# Altium project CT_ESP32.PrjPcb
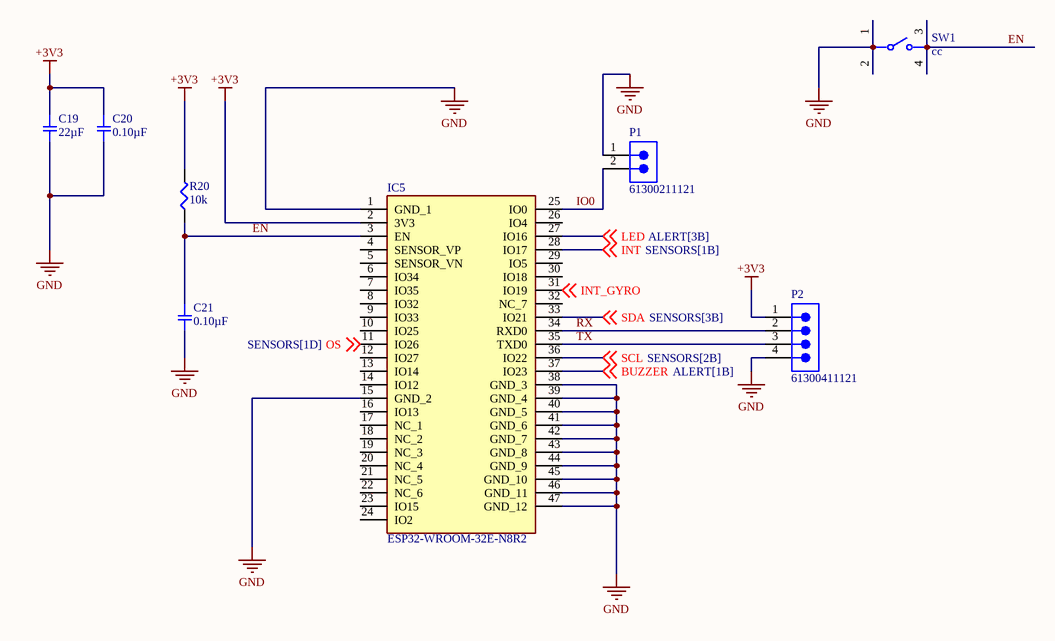
[diagram p0: MCU.SchDoc]
5 sheets, 71 parts. Net scope: global (net labels, ports and power ports of the same name join across sheets).
Board file: PCB1.PcbDoc
Sheets:
  MCU.SchDoc
  POWER.SchDoc
  CHARGING.SchDoc
  ALERT.SchDoc
  SENSORS.SchDoc

## Sheet MCU.SchDoc
size A; SheetNumber: 1; SheetTotal: 5

### Parts
C19  22µF  [SMD-0603C]
C20  0.10µF  [SMD-0603C]
C21  0.10µF  [SMD-0402C]
IC5  ESP32-WROOM-32E-N8R2  [ESP32WROOM32EN8R2]
P1  61300211121  [61300211121]
P2  61300411121  [61300411121]
R20  10k  [SMD-0402-RES]
SW1  cc  [FP-TL3305AF260QG-MFG]

### Nets
+3V3: C19.1 C20.1 IC5.2(3V3) P2.1 R20.2
GND: C19.2 C20.2 C21.2 IC5.1(GND_1) IC5.15(GND_2) IC5.38(GND_3) IC5.39(GND_4) IC5.40(GND_5) IC5.41(GND_6) IC5.42(GND_7) IC5.43(GND_8) IC5.44(GND_9) IC5.45(GND_10) IC5.46(GND_11) IC5.47(GND_12) P1.1 P2.4 SW1.1 SW1.2
BUZZER: IC5.37(IO23) ; off-sheet BUZZER
EN: C21.1 IC5.3(EN) R20.1 SW1.3 SW1.4
INT: IC5.28(IO17) ; off-sheet INT
INT_GYRO: IC5.31(IO19) ; off-sheet INT_GYRO
IO0: IC5.25(IO0) P1.2
LED: IC5.27(IO16) ; off-sheet LED
OS: IC5.11(IO26) ; off-sheet OS
RX: IC5.34(RXD0) P2.2
SCL: IC5.36(IO22) ; off-sheet SCL
SDA: IC5.33(IO21) ; off-sheet SDA
TX: IC5.35(TXD0) P2.3

Not connected (* = marked no-connect by the designer): IC5 4(SENSOR_VP) 5(SENSOR_VN) 6(IO34) 7(IO35) 8(IO32) 9(IO33) 10(IO25) 12(IO27) 13(IO14) 14(IO12) 16(IO13) 17(NC_1) 18(NC_2) 19(NC_3) 20(NC_4) 21(NC_5) 22(NC_6) 23(IO15) 24(IO2) 26(IO4) 29(IO5) 30(IO18) 32(NC_7)

### Library data of the parts
C19 = ZRB18AR60J226ME01L: CAP CER 22UF 6.3V X5R 0603; Manufacturer: Murata Electronics North America; Factory Stock: 0; Unit Price (USD): 0.44; Minimum Quantity: 1; Tolerance: ±20%; Datasheets: http://search.murata.co.jp/Ceramy/image/img/A01X/G101/ENG/ZRB18AR60J226ME01-01.pdf; Image: //media.digikey.com/Renders/Murata%20Renders/ZRB-SERIES-0603.jpg; Digi-Key Part Number: 490-10988-1-ND; Part Number: ZRB18AR60J226ME01L; Quantity Available: 3040; @ qty: 0; Packaging: Cut Tape (CT); Series: ZRB; Part Status: Active; Value: 22µF; Voltage: 6.3V; Temperature Coefficient: X5R; Operating Temperature: -55°C ~ 85°C; Features: Derating Recommended, Interposer Termination; Ratings: -; Applications: Acoustic Noise Reduction; Mounting Type: Surface Mount, MLCC; Package / Case: 0603 (1608 Metric); Size / Dimension: 0.063" L x 0.031" W (1.60mm x 0.80mm); Height - Seated (Max): -; Thickness (Max): 0.047" (1.20mm); Lead Spacing: -; Lead Style: -
C20 = GCJ188R71C104KA01D: CAP CER 0.1UF 16V X7R 0603; Manufacturer: Murata Electronics North America; Factory Stock: 0; Unit Price (USD): 0.21; Minimum Quantity: 1; Tolerance: ±10%; Datasheets: http://www.murata.com/~/media/webrenewal/support/library/catalog/products/capacitor/mlcc/c03e.ashx; Image: //media.digikey.com/Renders/Murata%20Renders/0603%28LQG18%29.jpg; Digi-Key Part Number: 490-5796-1-ND; Part Number: GCJ188R71C104KA01D; Quantity Available: 22473; @ qty: 0; Packaging: Cut Tape (CT); Series: GCJ; Part Status: Active; Value: 0.10µF; Voltage: 16V; Temperature Coefficient: X7R; Operating Temperature: -55°C ~ 125°C; Features: Soft Termination; Ratings: AEC-Q200; Applications: Automotive, Boardflex Sensitive; Mounting Type: Surface Mount, MLCC; Package / Case: 0603 (1608 Metric); Size / Dimension: 0.063" L x 0.031" W (1.60mm x 0.80mm); Height - Seated (Max): -; Thickness (Max): 0.035" (0.90mm); Lead Spacing: -; Lead Style: -
C21 = GCM155R71C104KA55D: CAP CER 0.1UF 16V X7R 0402; Manufacturer: Murata Electronics North America; Factory Stock: 0; Unit Price (USD): 0.1; Minimum Quantity: 1; Tolerance: ±10%; Datasheets: http://www.murata.com/~/media/webrenewal/support/library/catalog/products/capacitor/mlcc/c03e.ashx; Image: //media.digikey.com/Renders/Murata%20Renders/ZRB-SERIES-0402.jpg; Digi-Key Part Number: 490-4759-1-ND; Part Number: GCM155R71C104KA55D; Quantity Available: 734194; @ qty: 0; Packaging: Cut Tape (CT); Series: GCM; Part Status: Active; Value: 0.10µF; Voltage: 16V; Temperature Coefficient: X7R; Operating Temperature: -55°C ~ 125°C; Features: -; Ratings: AEC-Q200; Applications: Automotive; Mounting Type: Surface Mount, MLCC; Package / Case: 0402 (1005 Metric); Size / Dimension: 0.039" L x 0.020" W (1.00mm x 0.50mm); Height - Seated (Max): -; Thickness (Max): 0.022" (0.55mm); Lead Spacing: -; Lead Style: -
IC5 = ESP32-WROOM-32E-N8R2: Integrated Circuit; Manufacturer_Name: Espressif Systems; Datasheet Link: https://www.espressif.com/sites/default/files/documentation/esp32-wroom-32e_esp32-wroom-32ue_datasheet_en.pdf; Height: 3.25mm; Manufacturer_Part_Number: ESP32-WROOM-32E-N8R2; Mouser Part Number: 356-ESP32WRM32EN8R2; Mouser Price/Stock: https://www.mouser.co.uk/ProductDetail/Espressif-Systems/ESP32-WROOM-32E-N8R2?qs=By6Nw2ByBD0mvGJSS3Ohlw%3D%3D
P1 = CMP-1712-00002-6: NexarPartId: 20081794; Number of Contacts: 2; Pitch: 2.54mm; Connector Type: Male Pin; Voltage Rating: 250V; Current Rating: 3A; Gender: Male; Contact Resistance: 20mΩ; Height: 8.94mm; Lead Free: Lead Free; Number of Pins: 2; Termination: Through Hole; RoHS: Compliant; Lead Pitch: 2.54mm; REACH SVHC: No SVHC; Housing Material: PBT; Contact Mating Length: 5.9944mm; Min Operating Temperature: -40°C; Orientation: Vertical; Contact Material: Copper; Contact Gender: Male; Max Operating Temperature: 125°C; Number of Rows: 1; Number of Positions: 2; Packaging: Bulk; Contact Plating: Gold; Mount: Through Hole; Color: Black; Operating Supply Voltage: 250V
P2 = CMP-1502-01064-3: NexarPartId: 32855522; Operating Supply Voltage: 250V; Pitch: 2.54mm; Contact Resistance: 20mΩ; Number of Positions: 4; Current Rating: 3A; Connector Type: Male Pin; Gender: Male; Contact Plating: Gold; Height: 8.89mm; Lead Pitch: 2.54mm; Lead Free: Lead Free; Contact Mating Length: 5.9944mm; Number of Rows: 1; Termination: Solder; Packaging: Bulk; REACH SVHC: Unknown; Min Operating Temperature: -40°C; RoHS: Compliant; Number of Contacts: 4; Voltage Rating: 250V; Color: Black; Max Operating Temperature: 105°C; Contact Material: Copper; Mount: Through Hole; Orientation: Vertical; Number of Pins: 4
R20 = ERJ-2GEJ103X: RES SMD 10K OHM 5% 1/10W 0402; Manufacturer: Panasonic Electronic Components; Factory Stock: 0; Unit Price (USD): 0.00350; @ qty: 1500; Minimum Quantity: 1; Power (Watts): 0.1W, 1/10W; Temperature Coefficient: ±200ppm/°C; Part Number: ERJ-2GEJ103X; Datasheets: http://industrial.panasonic.com/www-cgi/jvcr13pz.cgi?E+PZ+3+AOA0001+ERJ2GEJ103X+7+WW; Image: //media.digikey.com/Photos/Panasonic%20Photos/ERJ-PA2-Series.jpg; Digi-Key Part Number: P10KJCT-ND; Quantity Available: 2560215; Packaging: Cut Tape (CT); Series: ERJ; Part Status: Active; Value: 10k; Tolerance: ±5%; Composition: Thick Film; Features: Automotive AEC-Q200; Operating Temperature: -55°C ~ 155°C; Package / Case: 0402 (1005 Metric); Supplier Device Package: 0402; Size / Dimension: 0.039" L x 0.020" W (1.00mm x 0.50mm); Height - Seated (Max): 0.016" (0.40mm); Number of Terminations: 2; Failure Rate: -
SW1 = CMP-17879-000010-1: SWITCH TACTILE SPST-NO 50MA 12V; Mechanical Life: 200000Cycles; Switch Function: Off-Mom; Actuator Type: Standard; Operating Force: 260gf; Illumination Type: Non-Illuminated; Switch Travel: 0.2mm; Throw Configuration: SPST; Min Operating Temperature: -20°C; Max Operating Temperature: 70°C; Lead Free: Lead Free; Mount: Surface Mount; Packaging: Tape and Reel; Termination: Gull Wing

## Sheet POWER.SchDoc
size A; SheetNumber: 2; SheetTotal: 5
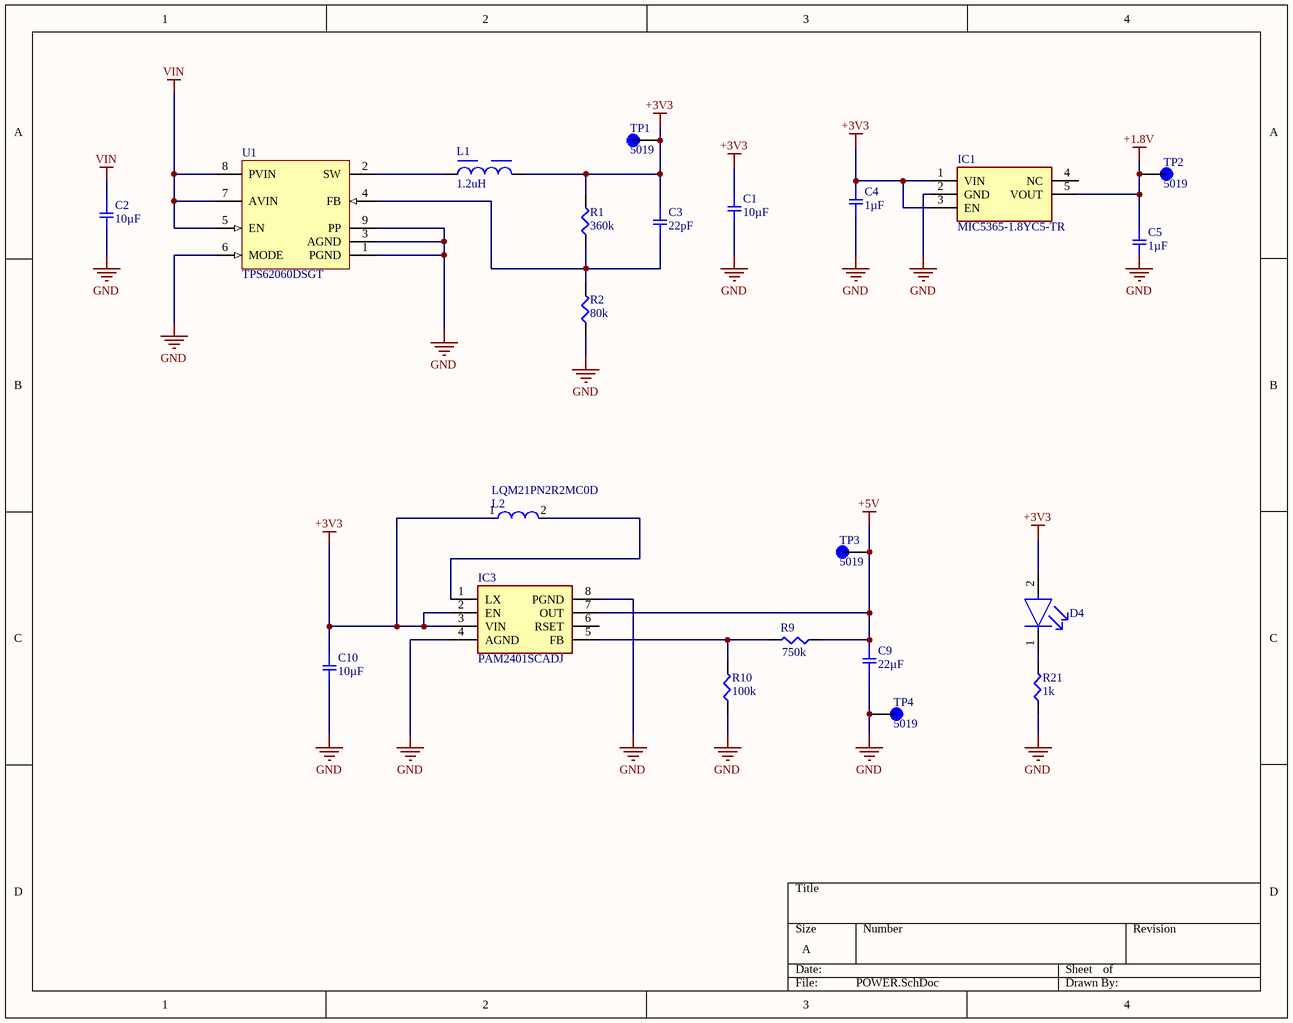
[diagram p1: POWER.SchDoc]

### Parts
C1  10µF  [SMD-0603C]
C2  10µF  [SMD-0603C]
C3  22pF  [SMD-0402C]
C4  1µF  [SMD-0402C]
C5  1µF  [SMD-0402C]
C9  22µF  [SMD-0603C]
C10  10µF  [SMD-0603C]
D4  APHHS1005CGCK  [FP-APHHS1005CGCK-MFG]  (value not drawn)
IC1  MIC5365-1.8YC5-TR  [SOT65P210X110-5N]
IC3  PAM2401SCADJ  [SOP65P490X110-8N]
L1  1.2uH  [WE-MAIA_1610]
L2  LQM21PN2R2MC0D  [FP-LQM21PN_C0-IPC_A]
R1  360k  [SMD-0402-RES]
R2  80k  [SMD-0402-RES]
R9  750k  [SMD-0402-RES]
R10  100k  [SMD-0402-RES]
R21  1k  [SMD-0402-RES]
TP1  5019  [KEYSTONE_5019]
TP2  5019  [KEYSTONE_5019]
TP3  5019  [KEYSTONE_5019]
TP4  5019  [KEYSTONE_5019]
U1  TPS62060DSGT  [DSG0008A_V]

### Nets
+1.8V: C5.1 IC1.5(VOUT) TP2.TP
+3V3: C1.1 C3.1 C4.1 C10.1 D4.2(A) IC1.1(VIN) IC1.3(EN) IC3.2(EN) IC3.3(VIN) L1.2 L2.1 R1.2 TP1.TP
+5V: C9.1 IC3.7(OUT) R9.1 TP3.TP
GND: C1.2 C2.2 C4.2 C5.2 C9.2 C10.2 IC1.2(GND) IC3.4(AGND) IC3.8(PGND) R2.1 R10.1 R21.1 TP4.TP U1.1(PGND) U1.3(AGND) U1.6(MODE) U1.9(PP)
VIN: C2.1 U1.5(EN) U1.7(AVIN) U1.8(PVIN)
NetC3_2: C3.2 R1.1 R2.2 U1.4(FB)
NetD4_1: D4.1(C) R21.2
NetIC3_1: IC3.1(LX) L2.2
NetIC3_5: IC3.5(FB) R9.2 R10.2
NetL1_1: L1.1 U1.2(SW)

Not connected (* = marked no-connect by the designer): IC1 4(NC); IC3 6(RSET)

### Library data of the parts
C1 C2 C10 = GRM188C81C106MA73D: CAP CER 10UF 16V X6S 0603; Manufacturer: Murata Electronics North America; Factory Stock: 0; Unit Price (USD): 0.34; Minimum Quantity: 1; Tolerance: ±20%; Datasheets: http://www.murata.com/~/media/webrenewal/support/library/catalog/products/capacitor/mlcc/c02e.pdf; Image: //media.digikey.com/Renders/Murata%20Renders/ZRB-SERIES-0402.jpg; Digi-Key Part Number: 490-7198-1-ND; Part Number: GRM188C81C106MA73D; Quantity Available: 215049; @ qty: 0; Packaging: Cut Tape (CT); Series: GRM; Part Status: Active; Value: 10µF; Voltage: 16V; Temperature Coefficient: X6S; Operating Temperature: -55°C ~ 105°C; Features: -; Ratings: -; Applications: General Purpose; Mounting Type: Surface Mount, MLCC; Package / Case: 0603 (1608 Metric); Size / Dimension: 0.063" L x 0.031" W (1.60mm x 0.80mm); Height - Seated (Max): -; Thickness (Max): 0.031" (0.80mm); Lead Spacing: -; Lead Style: -
C3 = GCM1555C1H220JA16D: CAP CER 22PF 50V NP0 0402; Manufacturer: Murata Electronics North America; Factory Stock: 0; Unit Price (USD): 0.1; Minimum Quantity: 1; Tolerance: ±5%; Temperature Coefficient: C0G, NP0; Datasheets: http://www.murata.com/~/media/webrenewal/support/library/catalog/products/capacitor/mlcc/c03e.ashx; Image: //media.digikey.com/Renders/Murata%20Renders/ZRB-SERIES-0402.jpg; Digi-Key Part Number: 490-9648-1-ND; Part Number: GCM1555C1H220JA16D; Quantity Available: 26532; @ qty: 0; Packaging: Cut Tape (CT); Series: GCM; Part Status: Active; Value: 22pF; Voltage: 50V; Operating Temperature: -55°C ~ 125°C; Features: -; Ratings: AEC-Q200; Applications: Automotive; Mounting Type: Surface Mount, MLCC; Package / Case: 0402 (1005 Metric); Size / Dimension: 0.039" L x 0.020" W (1.00mm x 0.50mm); Height - Seated (Max): -; Thickness (Max): 0.022" (0.55mm); Lead Spacing: -; Lead Style: -
C4 C5 = GCM155C71A105KE38D: CAP CER 1UF 10V X7S 0402; Manufacturer: Murata Electronics North America; Factory Stock: 0; Unit Price (USD): 0.12; Minimum Quantity: 1; Tolerance: ±10%; Datasheets: http://www.murata.com/~/media/webrenewal/support/library/catalog/products/capacitor/mlcc/c03e.ashx; Image: //media.digikey.com/Renders/Murata%20Renders/ZRB-SERIES-0402.jpg; Digi-Key Part Number: 490-13409-1-ND; Part Number: GCM155C71A105KE38D; Quantity Available: 7240; @ qty: 0; Packaging: Cut Tape (CT); Series: GCM; Part Status: Active; Value: 1µF; Voltage: 10V; Temperature Coefficient: X7S; Operating Temperature: -55°C ~ 125°C; Features: -; Ratings: AEC-Q200; Applications: Automotive; Mounting Type: Surface Mount, MLCC; Package / Case: 0402 (1005 Metric); Size / Dimension: 0.039" L x 0.020" W (1.00mm x 0.50mm); Height - Seated (Max): -; Thickness (Max): 0.022" (0.55mm); Lead Spacing: -; Lead Style: -
C9 = GRM188C60J226MEA0D: CAP CER 22UF 6.3V X5S 0603; Manufacturer: Murata Electronics North America; Factory Stock: 0; Unit Price (USD): 0.27; Minimum Quantity: 1; Tolerance: ±20%; Datasheets: http://www.murata.com/~/media/webrenewal/support/library/catalog/products/capacitor/mlcc/c02e.pdf; Image: //media.digikey.com/Renders/Murata%20Renders/ZRB-SERIES-0402.jpg; Digi-Key Part Number: 490-10468-1-ND; Part Number: GRM188C60J226MEA0D; Quantity Available: 3653; @ qty: 0; Packaging: Cut Tape (CT); Series: GRM; Part Status: Active; Value: 22µF; Voltage: 6.3V; Temperature Coefficient: X5S; Operating Temperature: -55°C ~ 85°C; Features: Derating Recommended; Ratings: -; Applications: General Purpose; Mounting Type: Surface Mount, MLCC; Package / Case: 0603 (1608 Metric); Size / Dimension: 0.063" L x 0.031" W (1.60mm x 0.80mm); Height - Seated (Max): -; Thickness (Max): 0.039" (1.00mm); Lead Spacing: -; Lead Style: -
D4 = CMP-44529-000044-1: LED GREEN CLEAR CHIP SMD; Viewing Angle: 120°; Dominant Wavelength: 570nm; Test Current: 20mA; Luminous Intensity: 50mcd; Forward Voltage: 2.1V; Number of LEDs: 1; Lens Color: Clear; Packaging: Tape and Reel; Max Operating Temperature: 85°C; Illumination Color: Green; Length: 1mm; Mount: Surface Mount; Lens Style: Clear; Color: Green; Number of Pins: 2; Wavelength: 570nm; Case/Package: 0402; Width: 0.5mm; Package Quantity: 2000; Case Code (Metric): 1005; Height: 0.6mm; Lead Free: Lead Free; Case Code (Imperial): 0402; Forward Current: 20mA; Min Operating Temperature: -40°C
IC1 = MIC5365-1.8YC5-TR: Integrated Circuit; Manufacturer_Name: Microchip; Datasheet Link: http://ww1.microchip.com/downloads/en/DeviceDoc/mic5365.pdf; Height: 1.1mm; Manufacturer_Part_Number: MIC5365-1.8YC5-TR; Mouser Part Number: 998-MIC5365-1.8YC5TR; Mouser Price/Stock: https://www.mouser.co.uk/ProductDetail/Microchip-Technology/MIC5365-1.8YC5-TR?qs=U6T8BxXiZAUJRWmX5wGIlA%3D%3D; Arrow Part Number: MIC5365-1.8YC5-TR; Arrow Price/Stock: https://www.arrow.com/en/products/mic5365-1.8yc5-tr/microchip-technology?utm_currency=USD&region=nac
IC3 = PAM2401SCADJ: Integrated Circuit; Manufacturer_Name: Diodes Incorporated; Datasheet Link: https://www.diodes.com//assets/Datasheets/PAM2401.pdf; Height: 1.1mm; Manufacturer_Part_Number: PAM2401SCADJ; Mouser Part Number: 621-PAM2401SCADJ; Mouser Price/Stock: https://www.mouser.co.uk/ProductDetail/Diodes-Incorporated/PAM2401SCADJ?qs=Ay79KZaUeZCprHtLIDXq%252BQ%3D%3D; Arrow Part Number: PAM2401SCADJ; Arrow Price/Stock: https://www.arrow.com/en/products/pam2401scadj/diodes-incorporated?region=nac
L1 = CMP-03913-119894041-2: 78438313012 Power Inductor, Aec-Q200, 1.2Uh, 1.3A Rohs Compliant: Yes; DC Resistance (DCR): 140mΩ; Inductance: 1.2µH; Ambient Temperature Range High: 85°C; Height: 1mm; Current Rating: 1.3A; Max Operating Temperature: 125°C; Min Operating Temperature: -40°C; Length: 1.6mm; NexarPartId: 119894041; RoHS: Compliant; Ambient Temperature Range Low: -40°C; Width: 1.6mm
L2 = CMP-06042-016994-1: Multilayer Type Inductor for Power Lines, 0805 (2012), 2.2μH, 20%, 0.425Ω, 0.6A; Test Frequency: 1MHz; Inductance: 2.2uH; Max DC Current: 600mA; Core Material: Ferrite; DC Resistance (DCR): 340mR; Shielding: Shielded; Self Resonant Frequency: 50MHz; RoHS Compliant: Yes; Height: 0.5mm; Mount: Surface Mount; REACH SVHC: No SVHC; Width: 0.049inch; Military Standard: Not; Max Operating Temperature: 125°C; Lead Free: Lead Free; Tolerance: 20%; Series: LQM21PN_CO; Case Code (Imperial): 0805; Case Code (Metric): 2012; Length: 2mm; Package Quantity: 4000; Radiation Hardening: No; Termination: SMD/SMT; Inductance Tolerance: 20%; Rated Current-Max: 600mA; Current Rating: 600mA; Min Operating Temperature: -55°C; Case/Package: 0805; Height - Seated (Max): 0.022inch; Depth: 1.45mm; Packaging: Tape and Reel; DC Current: 600mA
R1 R2 = ERJ-2GEJ364X: RES SMD 360K OHM 5% 1/10W 0402; Manufacturer: Panasonic Electronic Components; Factory Stock: 0; Unit Price (USD): 0.00350; @ qty: 1500; Minimum Quantity: 1; Power (Watts): 0.1W, 1/10W; Temperature Coefficient: ±200ppm/°C; Part Number: ERJ-2GEJ364X; Datasheets: http://industrial.panasonic.com/www-cgi/jvcr13pz.cgi?E+PZ+3+AOA0001+ERJ2GEJ364X+7+WW; Image: //media.digikey.com/Photos/Panasonic%20Photos/ERJ-PA2-Series.jpg; Digi-Key Part Number: P360KJCT-ND; Quantity Available: 75680; Packaging: Cut Tape (CT); Series: ERJ; Part Status: Active; Value: 360k; Tolerance: ±5%; Composition: Thick Film; Features: Automotive AEC-Q200; Operating Temperature: -55°C ~ 155°C; Package / Case: 0402 (1005 Metric); Supplier Device Package: 0402; Size / Dimension: 0.039" L x 0.020" W (1.00mm x 0.50mm); Height - Seated (Max): 0.016" (0.40mm); Number of Terminations: 2; Failure Rate: -
R9 = ERJ-2RKF7503X: RES SMD 750K OHM 1% 1/10W 0402; Manufacturer: Panasonic Electronic Components; Factory Stock: 0; Unit Price (USD): 0.00496; @ qty: 1500; Minimum Quantity: 1; Power (Watts): 0.1W, 1/10W; Temperature Coefficient: ±100ppm/°C; Part Number: ERJ-2RKF7503X; Datasheets: http://industrial.panasonic.com/www-cgi/jvcr13pz.cgi?E+PZ+3+AOA0002+ERJ2RKF7503X+7+WW; Image: //media.digikey.com/Photos/Panasonic%20Photos/ERJ-PA2-Series.jpg; Digi-Key Part Number: P750KLCT-ND; Quantity Available: 78807; Packaging: Cut Tape (CT); Series: ERJ; Part Status: Active; Value: 750k; Tolerance: ±1%; Composition: Thick Film; Features: Automotive AEC-Q200; Operating Temperature: -55°C ~ 155°C; Package / Case: 0402 (1005 Metric); Supplier Device Package: 0402; Size / Dimension: 0.039" L x 0.020" W (1.00mm x 0.50mm); Height - Seated (Max): 0.016" (0.40mm); Number of Terminations: 2; Failure Rate: -
R10 = ERJ-2GEJ104X: RES SMD 100K OHM 5% 1/10W 0402; Manufacturer: Panasonic Electronic Components; Factory Stock: 0; Unit Price (USD): 0.00350; @ qty: 1500; Minimum Quantity: 1; Power (Watts): 0.1W, 1/10W; Temperature Coefficient: ±200ppm/°C; Part Number: ERJ-2GEJ104X; Datasheets: http://industrial.panasonic.com/www-cgi/jvcr13pz.cgi?E+PZ+3+AOA0001+ERJ2GEJ104X+7+WW; Image: //media.digikey.com/Photos/Panasonic%20Photos/ERJ-PA2-Series.jpg; Digi-Key Part Number: P100KJCT-ND; Quantity Available: 2387986; Packaging: Cut Tape (CT); Series: ERJ; Part Status: Active; Value: 100k; Tolerance: ±5%; Composition: Thick Film; Features: Automotive AEC-Q200; Operating Temperature: -55°C ~ 155°C; Package / Case: 0402 (1005 Metric); Supplier Device Package: 0402; Size / Dimension: 0.039" L x 0.020" W (1.00mm x 0.50mm); Height - Seated (Max): 0.016" (0.40mm); Number of Terminations: 2; Failure Rate: -
R21 = ERJ-2GEJ102X: RES SMD 1K OHM 5% 1/10W 0402; Manufacturer: Panasonic Electronic Components; Factory Stock: 0; Unit Price (USD): 0.00350; @ qty: 1500; Minimum Quantity: 1; Power (Watts): 0.1W, 1/10W; Temperature Coefficient: ±200ppm/°C; Part Number: ERJ-2GEJ102X; Datasheets: http://industrial.panasonic.com/www-cgi/jvcr13pz.cgi?E+PZ+3+AOA0001+ERJ2GEJ102X+7+WW; Image: //media.digikey.com/Photos/Panasonic%20Photos/ERJ-PA2-Series.jpg; Digi-Key Part Number: P1.0KJCT-ND; Quantity Available: 1939857; Packaging: Cut Tape (CT); Series: ERJ; Part Status: Active; Value: 1k; Tolerance: ±5%; Composition: Thick Film; Features: Automotive AEC-Q200; Operating Temperature: -55°C ~ 155°C; Package / Case: 0402 (1005 Metric); Supplier Device Package: 0402; Size / Dimension: 0.039" L x 0.020" W (1.00mm x 0.50mm); Height - Seated (Max): 0.016" (0.40mm); Number of Terminations: 2; Failure Rate: -
TP1-TP4 = 5019: SMT Test Point- Mininature-1000 pc Reels; MF: Keystone Electronics; Value: *; MP: 5019; Availability: In Stock; Purchase-URL: https://pricing.snapeda.com/search/part/5019/?ref=eda; Package: None; Price: None
U1 = CMP-0323-00258-3: Buck Step Down Regulator with 2.7 to 6 V Input and 0.8 to 6 V Output, -40 to 85 degC, 8-Pin WSON (DSG), Green (RoHS & no Sb/Br); Manufacturer: Texas Instruments; Regulated Outputs(#): 1; Vout(Max)(V): 6; Synchronous Rectification: TRUE; Vin(Min)(V): 2.7; Rating: Catalog; Switch Current Limit(Typ)(A): 2.25; Iout(Max)(A): 1.6; Duty Cycle(Max)(%): 100; Iq(Typ)(mA): 0.018; Vout(Min)(V): 0.8; SubFamily: Step-Down Regulator; Eco-Plan: Green (RoHS & no Sb/Br); ComponentLink1URL: http://www.ti.com/general/docs/lit/getliterature.tsp?genericPartNumber=TPS62060&fileType=pdf; Topology: Buck; PackageReference: DSG0008A; ComponentLink2URL: http://www.ti.com/litv/pdf/mpds308a; PackageVersion: revB, Oct-2010; PartNumber: TPS62060DSGT; Mounting Technology: Surface Mount; Vin(Max)(V): 6; Code_JEDEC: MO-229; ComponentLink3URL: Samples URL:http://www.ti.com/product/tps54611#samples; PackageDescription: 8-Pin Plastic Small Outline No-Lead, 2 x 2 x 0.8 mm Body, 0.5 mm Pitch, Exposed Pad; ComponentLink3Description: URL Link1; ComponentLink2Description: Package Specification; DatasheetVersion: SLVSA95A; ComponentLink1Description: Datasheet

## Sheet CHARGING.SchDoc
size A; SheetNumber: 3; SheetTotal: 5
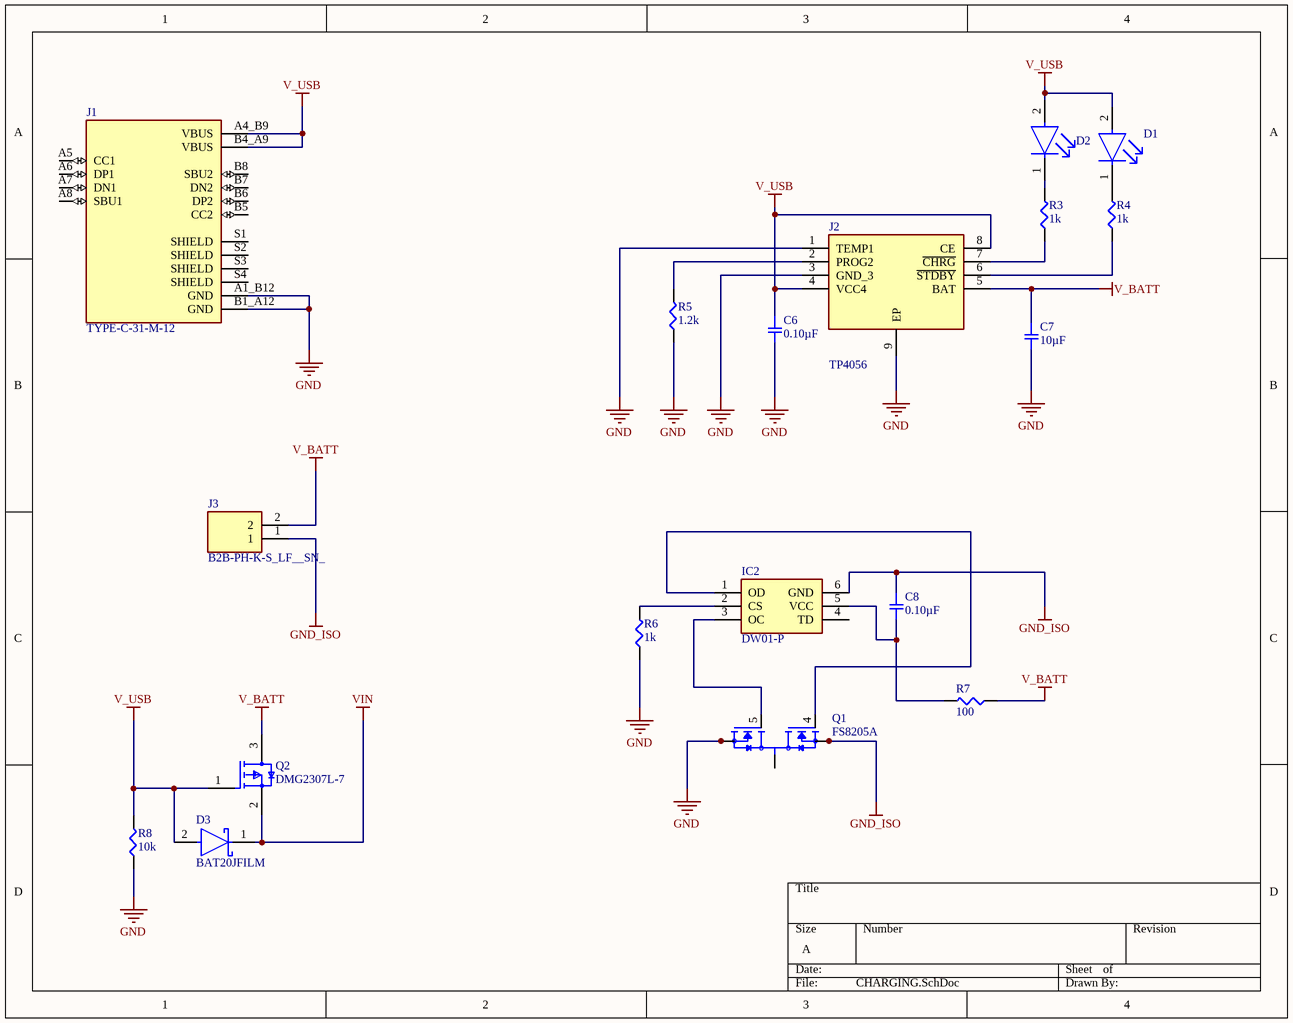
[diagram p2: CHARGING.SchDoc]

### Parts
C6  0.10µF  [SMD-0402C]
C7  10µF  [SMD-0402C]
C8  0.10µF  [SMD-0402C]
D1  SML-P12VTT86R  [FP-SML-P1-MFG]  (value not drawn)
D2  APHHS1005CGCK  [FP-APHHS1005CGCK-MFG]  (value not drawn)
D3  BAT20JFILM  [FP-BAT20JFILM-MFG]
IC2  DW01-P  [SOT95P280X135-6N]
J1  TYPE-C-31-M-12  [HRO_TYPE-C-31-M-12]
J2  TP4056  [SOIC127P600X175-9N]
J3  B2B-PH-K-S_LF__SN_  [SHDR2W50P0X200_1X2_590X450X600P]
Q1  FS8205A  [SOP65P640X120-8N]
Q2  DMG2307L-7  [FP-SOT23-MFG]
R3  1k  [SMD-0402-RES]
R4  1k  [SMD-0402-RES]
R5  1.2k  [SMD-0402-RES]
R6  1k  [SMD-0402-RES]
R7  100  [SMD-0402-RES]
R8  10k  [SMD-0402-RES]

### Nets
GND: C6.2 C7.2 J1.A1_B12(GND) J1.B1_A12(GND) J2.1(TEMP1) J2.3(GND_3) J2.9(EP) Q1.6(S2) Q1.7(S2) R5.1 R6.1 R8.1
GND_ISO: C8.1 IC2.6(GND) J3.1 Q1.2(S1) Q1.3(S1)
V_BATT: C7.1 J2.5(BAT) J3.2 Q2.3(D) R7.1
V_USB: C6.1 D1.2(A) D2.2(A) D3.2(A) J1.A4_B9(VBUS) J1.B4_A9(VBUS) J2.4(VCC4) J2.8(CE) Q2.1(G) R8.2
VIN: D3.1(K) Q2.2(S)
NetC8_2: C8.2 IC2.5(VCC) R7.2
NetD1_1: D1.1(C) R4.2
NetD2_1: D2.1(C) R3.2
NetIC2_1: IC2.1(OD) Q1.4(G1)
NetIC2_2: IC2.2(CS) R6.2
NetIC2_3: IC2.3(OC) Q1.5(G2)
NetJ2_2: J2.2(PROG2) R5.2
NetJ2_6: J2.6(~{STDBY}) R4.1
NetJ2_7: J2.7(~{CHRG}) R3.1
NetQ1_1: Q1.1(D12) Q1.8(D12)

Not connected (* = marked no-connect by the designer): IC2 4(TD); J1 A5(CC1) A6(DP1) A7(DN1) A8(SBU1) B5(CC2) B6(DP2) B7(DN2) B8(SBU2) S1(SHIELD) S2(SHIELD) S3(SHIELD) S4(SHIELD)

### Library data of the parts
C6 C8 = GCM155R71C104KA55D: as C21 on sheet MCU; Datasheets: http://www.murata.com/~/media/webrenewal/support/library/catalog/products/capacitor/mlcc/c03e.ashx; Image: //media.digikey.com/Renders/Murata%20Renders/ZRB-SERIES-0402.jpg; Digi-Key Part Number: 490-4759-1-ND; Part Number: GCM155R71C104KA55D; Quantity Available: 734194; @ qty: 0; Packaging: Cut Tape (CT); Series: GCM; Part Status: Active; Value: 0.10µF; Voltage: 16V; Temperature Coefficient: X7R; Operating Temperature: -55°C ~ 125°C; Features: -; Ratings: AEC-Q200; Applications: Automotive; Mounting Type: Surface Mount, MLCC; Package / Case: 0402 (1005 Metric); Size / Dimension: 0.039" L x 0.020" W (1.00mm x 0.50mm); Height - Seated (Max): -; Thickness (Max): 0.022" (0.55mm); Lead Spacing: -; Lead Style: -
C7 = GRJ155R60J106ME11D: CAP CER 10UF 6.3V X5R 0402; Manufacturer: Murata Electronics North America; Factory Stock: 0; Unit Price (USD): 0.23; Minimum Quantity: 1; Tolerance: ±20%; Datasheets: http://psearch.en.murata.com/capacitor/product/GRJ155R60J106ME11%23.pdf; Image: //media.digikey.com/Renders/Murata%20Renders/ZRB-SERIES-0402.jpg; Digi-Key Part Number: 490-13211-1-ND; Part Number: GRJ155R60J106ME11D; Quantity Available: 64064; @ qty: 0; Packaging: Cut Tape (CT); Series: GRJ; Part Status: Active; Value: 10µF; Voltage: 6.3V; Temperature Coefficient: X5R; Operating Temperature: -55°C ~ 85°C; Features: Derating Recommended, Soft Termination; Ratings: -; Applications: Boardflex Sensitive; Mounting Type: Surface Mount, MLCC; Package / Case: 0402 (1005 Metric); Size / Dimension: 0.039" L x 0.020" W (1.00mm x 0.50mm); Height - Seated (Max): -; Thickness (Max): 0.028" (0.70mm); Lead Spacing: -; Lead Style: -
D1 = CMP-08952-000002-1: LED RED CLEAR 0402 SMD; Manufacturer: Rohm; Wavelength: 630nm; Luminous Intensity: 60mcd; Led Orientation: Top View; Forward Current: 20mA; Reverse Voltage: 5V; Power Dissipation: 50mW; Forward Voltage: 2V; Mouser Description: SML-P1 Series Red 0402 Clear 60 mcd 2V Surface Mount PICOLED? LED; Package: SML-P1; Colour: Red; Temperature Range Low: -40°C; Octopart: https://octopart.com/sml-p12vtt86r-rohm-34112315; Automotive: No; Temperature: -40°C to +85°C; Digikey Description: LED RED CLEAR 0402 SMD; ComponentLink2URL: https://www.rohm.com/datasheet/SML-P12VT(R)/sml-p1-e; Device Class L1: Optoelectronics; Device Class L3: unset; Category: Diode; Temperature Range High: +85°C; ComponentLink2Description: Datasheet; Lead Free: Yes; Manufacturer Part Number: SML-P12VTT86R; RoHS: TRUE; Device Class L2: LEDs; Height: 0.25mm
D2 = CMP-44529-000044-1: as D4 on sheet POWER; Lens Color: Clear; Packaging: Tape and Reel; Max Operating Temperature: 85°C; Illumination Color: Green; Length: 1mm; Mount: Surface Mount; Lens Style: Clear; Color: Green; Number of Pins: 2; Wavelength: 570nm; Case/Package: 0402; Width: 0.5mm; Package Quantity: 2000; Case Code (Metric): 1005; Height: 0.6mm; Lead Free: Lead Free; Case Code (Imperial): 0402; Forward Current: 20mA; Min Operating Temperature: -40°C
D3 = CMP-12187-000030-1: DIODE SCHOTTKY 23V 1A SOD323; Polarity: Standard; Element Configuration: Single; Capacitance: 30pF; Forward Voltage: 620mV; Max Surge Current: 5A; Peak Reverse Current: 12uA; Packaging: Tape and Reel; Weight: 0.01lb; Output Current: 1A; Lead Free: Lead Free; Forward Current: 1A; Mount: Surface Mount; Max Reverse Voltage (DC): 23V; Average Rectified Current: 1A; Max Operating Temperature: 150°C; Max Forward Surge Current (Ifsm): 5A; REACH SVHC: No SVHC; Current Rating: 1A; Length: 1.8mm; Radiation Hardening: No; Max Reverse Leakage Current: 12uA; Voltage Rating (DC): 23V; Height: 1.03mm; Peak Non-Repetitive Surge Current: 5A; Max Repetitive Reverse Voltage (Vrrm): 23V; Min Operating Temperature: -65°C; Number of Pins: 2; Width: 1.35mm; Package Quantity: 1
IC2 = DW01-P: Integrated Circuit; Manufacturer_Name: Fortune Semiconductor Corporation; Datasheet Link: https://cdn.sparkfun.com/assets/learn_tutorials/2/5/1/DW01-P_DataSheet_V10.pdf; Height: 1.35mm; Manufacturer_Part_Number: DW01-P
J1 = TYPE-C-31-M-12: USB Connectors 24 Receptacle 1 8.94*7.3mm RoHS; MF: HRO Electronics Co., Ltd.; Price: None; Value: *; SnapEDA_Link: https://www.snapeda.com/parts/TYPE-C-31-M-12/HRO+Electronics+Co.%252C+Ltd./view-part/?ref=snap; Package: Package; Availability: Not in stock; Check_prices: https://www.snapeda.com/parts/TYPE-C-31-M-12/HRO+Electronics+Co.%252C+Ltd./view-part/?ref=eda; MP: TYPE-C-31-M-12
J2 = TP4056: Connector; Manufacturer_Name: NanJing Top Power; Datasheet Link: https://dlnmh9ip6v2uc.cloudfront.net/datasheets/Prototyping/TP4056.pdf; Height: 1.75mm; Manufacturer_Part_Number: TP4056
J3 = B2B-PH-K-S_LF__SN_: Connector; Manufacturer_Name: JST (JAPAN SOLDERLESS TERMINALS); Manufacturer_Part_Number: B2B-PH-K-S(LF)(SN); Datasheet Link: https://datasheet.lcsc.com/szlcsc/JST-Sales-America-B2B-PH-K-S-LF-SN_C131337.pdf; Height: 6mm; Mouser Part Number: 306-B2BPHKSLFSNPP; Mouser Price/Stock: https://www.mouser.co.uk/ProductDetail/JST-Commercial/B2B-PH-K-SLFSN?qs=cdbOS8ANM9AlozzPlOt72g%3D%3D; Arrow Part Number: B2B-PH-K-S(LF)(SN); Arrow Price/Stock: https://www.arrow.com/en/products/b2b-ph-k-s-lf-sn/jst-manufacturing?utm_currency=USD&region=europe
Q1 = FS8205A: MF: Fortune Semiconductor; SnapEDA_Link: https://www.snapeda.com/parts/FS8205A/Fortune+Semiconductor/view-part/?ref=snap; Package: Package; Value: *; MP: FS8205A; Check_prices: https://www.snapeda.com/parts/FS8205A/Fortune+Semiconductor/view-part/?ref=eda
Q2 = CMP-12801-000080-1: MOSFET P-CH 30V 2.5A SOT-23; Gate to Source Voltage (Vgs): 20V; Rise Time: 7.3ns; Power Dissipation: 1.36W; Rds On Max: 90mR; Fall Time: 13.4ns; Number of Channels: 1; Turn-On Delay Time: 4.8ns; Element Configuration: Single; Turn-Off Delay Time: 22.4ns; Input Capacitance: 371.3pF; Continuous Drain Current (ID): 3.8A; Max Power Dissipation: 760mW; Min Operating Temperature: -55°C; Width: 1.4mm; Packaging: Tape and Reel; Max Operating Temperature: 150°C; Case/Package: SOT-23; Weight: 0.000282oz; Length: 3mm; Lead Free: Lead Free; Package Quantity: 3000; Radiation Hardening: No; Drain to Source Resistance: 90mR; Height: 1mm; REACH SVHC: No SVHC; Number of Pins: 3; Number of Elements: 1; Drain to Source Voltage (Vdss): 30V; Mount: Surface Mount
R3 R4 R6 = ERJ-2GEJ102X: as R21 on sheet POWER; Part Number: ERJ-2GEJ102X; Datasheets: http://industrial.panasonic.com/www-cgi/jvcr13pz.cgi?E+PZ+3+AOA0001+ERJ2GEJ102X+7+WW; Image: //media.digikey.com/Photos/Panasonic%20Photos/ERJ-PA2-Series.jpg; Digi-Key Part Number: P1.0KJCT-ND; Quantity Available: 1939857; Packaging: Cut Tape (CT); Series: ERJ; Part Status: Active; Value: 1k; Tolerance: ±5%; Composition: Thick Film; Features: Automotive AEC-Q200; Operating Temperature: -55°C ~ 155°C; Package / Case: 0402 (1005 Metric); Supplier Device Package: 0402; Size / Dimension: 0.039" L x 0.020" W (1.00mm x 0.50mm); Height - Seated (Max): 0.016" (0.40mm); Number of Terminations: 2; Failure Rate: -
R5 = ERJ-2GEJ122X: RES SMD 1.2K OHM 5% 1/10W 0402; Manufacturer: Panasonic Electronic Components; Factory Stock: 0; Unit Price (USD): 0.00350; @ qty: 1500; Minimum Quantity: 1; Power (Watts): 0.1W, 1/10W; Temperature Coefficient: ±200ppm/°C; Part Number: ERJ-2GEJ122X; Datasheets: http://industrial.panasonic.com/www-cgi/jvcr13pz.cgi?E+PZ+3+AOA0001+ERJ2GEJ122X+7+WW; Image: //media.digikey.com/Photos/Panasonic%20Photos/ERJ-PA2-Series.jpg; Digi-Key Part Number: P1.2KJCT-ND; Quantity Available: 248948; Packaging: Cut Tape (CT); Series: ERJ; Part Status: Active; Value: 1.2k; Tolerance: ±5%; Composition: Thick Film; Features: Automotive AEC-Q200; Operating Temperature: -55°C ~ 155°C; Package / Case: 0402 (1005 Metric); Supplier Device Package: 0402; Size / Dimension: 0.039" L x 0.020" W (1.00mm x 0.50mm); Height - Seated (Max): 0.016" (0.40mm); Number of Terminations: 2; Failure Rate: -
R7 = ERJ-2RHD1000X: RES SMD 100 OHM 0.5% 1/16W 0402; Manufacturer: Panasonic Electronic Components; Factory Stock: 0; Unit Price (USD): 0.01767; @ qty: 1500; Minimum Quantity: 1; Power (Watts): 0.063W, 1/16W; Temperature Coefficient: ±50ppm/°C; Part Number: ERJ-2RHD1000X; Datasheets: http://industrial.panasonic.com/www-cgi/jvcr13pz.cgi?E+PZ+3+AOA0001+ERJ2RHD1000X+8+WW; Image: //media.digikey.com/Photos/Panasonic%20Photos/ERJ-PA2-Series.jpg; Digi-Key Part Number: P15983CT-ND; Quantity Available: 37495; Packaging: Cut Tape (CT); Series: ERJ; Part Status: Active; Value: 100; Tolerance: ±0.5%; Composition: Thick Film; Features: Automotive AEC-Q200; Operating Temperature: -55°C ~ 125°C; Package / Case: 0402 (1005 Metric); Supplier Device Package: 0402; Size / Dimension: 0.039" L x 0.020" W (1.00mm x 0.50mm); Height - Seated (Max): 0.016" (0.40mm); Number of Terminations: 2; Failure Rate: -
R8 = ERJ-2GEJ103X: as R20 on sheet MCU; Part Number: ERJ-2GEJ103X; Datasheets: http://industrial.panasonic.com/www-cgi/jvcr13pz.cgi?E+PZ+3+AOA0001+ERJ2GEJ103X+7+WW; Image: //media.digikey.com/Photos/Panasonic%20Photos/ERJ-PA2-Series.jpg; Digi-Key Part Number: P10KJCT-ND; Quantity Available: 2560215; Packaging: Cut Tape (CT); Series: ERJ; Part Status: Active; Value: 10k; Tolerance: ±5%; Composition: Thick Film; Features: Automotive AEC-Q200; Operating Temperature: -55°C ~ 155°C; Package / Case: 0402 (1005 Metric); Supplier Device Package: 0402; Size / Dimension: 0.039" L x 0.020" W (1.00mm x 0.50mm); Height - Seated (Max): 0.016" (0.40mm); Number of Terminations: 2; Failure Rate: -

## Sheet ALERT.SchDoc
size A; SheetNumber: 4; SheetTotal: 5
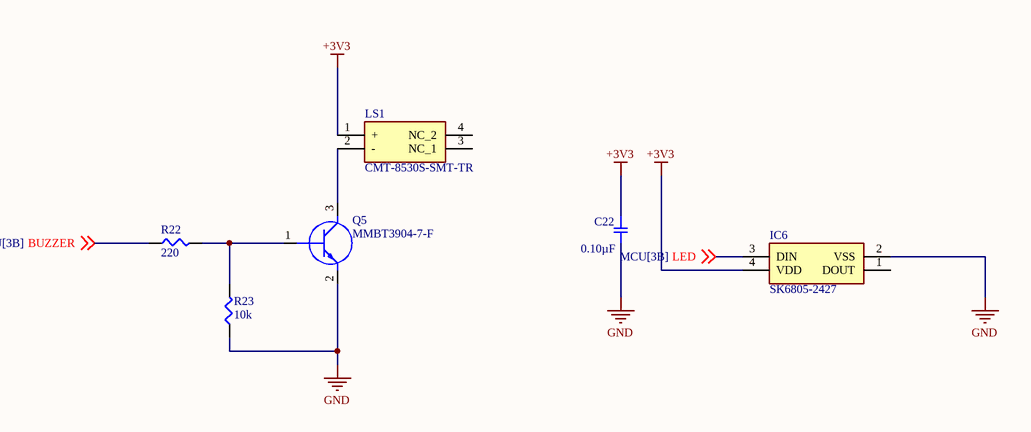
[diagram p3: ALERT.SchDoc]

### Parts
C22  0.10µF  [SMD-0402C]
IC6  SK6805-2427  [SK68052427]
LS1  CMT-8530S-SMT-TR  [CMT8530SSMTTR]
Q5  MMBT3904-7-F  [SOT96P240X110-3N]
R22  220  [SMD-0402-RES]
R23  10k  [SMD-0402-RES]

### Nets
+3V3: C22.1 IC6.4(VDD) LS1.1(+)
GND: C22.2 IC6.2(VSS) Q5.2(E) R23.1
BUZZER: R22.1 ; off-sheet BUZZER
LED: IC6.3(DIN) ; off-sheet LED
NetLS1_2: LS1.2(-) Q5.3(C)
NetQ5_1: Q5.1(B) R22.2 R23.2

Not connected (* = marked no-connect by the designer): IC6 1(DOUT); LS1 3(NC_1) 4(NC_2)

### Library data of the parts
C22 = GCM155R71C104KA55D: as C21 on sheet MCU; Datasheets: http://www.murata.com/~/media/webrenewal/support/library/catalog/products/capacitor/mlcc/c03e.ashx; Image: //media.digikey.com/Renders/Murata%20Renders/ZRB-SERIES-0402.jpg; Digi-Key Part Number: 490-4759-1-ND; Part Number: GCM155R71C104KA55D; Quantity Available: 734194; @ qty: 0; Packaging: Cut Tape (CT); Series: GCM; Part Status: Active; Value: 0.10µF; Voltage: 16V; Temperature Coefficient: X7R; Operating Temperature: -55°C ~ 125°C; Features: -; Ratings: AEC-Q200; Applications: Automotive; Mounting Type: Surface Mount, MLCC; Package / Case: 0402 (1005 Metric); Size / Dimension: 0.039" L x 0.020" W (1.00mm x 0.50mm); Height - Seated (Max): -; Thickness (Max): 0.022" (0.55mm); Lead Spacing: -; Lead Style: -
IC6 = SK6805-2427: Integrated Circuit; Manufacturer_Name: Adafruit; Datasheet Link: https://cdn-shop.adafruit.com/product-files/3484/3484_Datasheet.pdf; Height: 1.1mm; Manufacturer_Part_Number: SK6805-2427
LS1 = CMT-8530S-SMT-TR: Loudspeaker or Buzzer; Manufacturer_Name: Same Sky; Datasheet Link: https://www.sameskydevices.com/product/resource/supplyframepdf/cmt-8530s-smt-tr.pdf; Height: 3.5mm; Manufacturer_Part_Number: CMT-8530S-SMT-TR; Mouser Part Number: 490-CMT-8530S-SMT-TR; Mouser Price/Stock: https://www.mouser.co.uk/ProductDetail/Same-Sky/CMT-8530S-SMT-TR?qs=qCxwlXJ4fnxl6A4lXsnRBQ%3D%3D; Arrow Part Number: CMT-8530S-SMT-TR; Arrow Price/Stock: https://www.arrow.com/en/products/cmt-8530s-smt-tr/cui-devices?utm_currency=USD&region=nac
Q5 = MMBT3904-7-F: Transistor BJT NPN; Manufacturer_Name: Diodes Incorporated; Datasheet Link: https://www.diodes.com//assets/Datasheets/MMBT3904.pdf; Height: 1.1mm; Manufacturer_Part_Number: MMBT3904-7-F; Mouser Part Number: 621-MMBT3904-F; Mouser Price/Stock: https://www.mouser.co.uk/ProductDetail/Diodes-Incorporated/MMBT3904-7-F?qs=7F%2FY8wl6X3H3eL7tHVWSBQ%3D%3D; Arrow Part Number: MMBT3904-7-F; Arrow Price/Stock: https://www.arrow.com/en/products/mmbt3904-7-f/diodes-incorporated?utm_currency=USD&region=europe
R22 = ERJ-2RKF2200X: RES SMD 220 OHM 1% 1/10W 0402; Manufacturer: Panasonic Electronic Components; Factory Stock: 0; Unit Price (USD): 0.00496; @ qty: 1500; Minimum Quantity: 1; Power (Watts): 0.1W, 1/10W; Temperature Coefficient: ±100ppm/°C; Part Number: ERJ-2RKF2200X; Datasheets: http://industrial.panasonic.com/www-cgi/jvcr13pz.cgi?E+PZ+3+AOA0002+ERJ2RKF2200X+7+WW; Image: //media.digikey.com/Photos/Panasonic%20Photos/ERJ-PA2-Series.jpg; Digi-Key Part Number: P220LCT-ND; Quantity Available: 432220; Packaging: Cut Tape (CT); Series: ERJ; Part Status: Active; Value: 220; Tolerance: ±1%; Composition: Thick Film; Features: Automotive AEC-Q200; Operating Temperature: -55°C ~ 155°C; Package / Case: 0402 (1005 Metric); Supplier Device Package: 0402; Size / Dimension: 0.039" L x 0.020" W (1.00mm x 0.50mm); Height - Seated (Max): 0.016" (0.40mm); Number of Terminations: 2; Failure Rate: -
R23 = ERJ-2GEJ103X: as R20 on sheet MCU; Part Number: ERJ-2GEJ103X; Datasheets: http://industrial.panasonic.com/www-cgi/jvcr13pz.cgi?E+PZ+3+AOA0001+ERJ2GEJ103X+7+WW; Image: //media.digikey.com/Photos/Panasonic%20Photos/ERJ-PA2-Series.jpg; Digi-Key Part Number: P10KJCT-ND; Quantity Available: 2560215; Packaging: Cut Tape (CT); Series: ERJ; Part Status: Active; Value: 10k; Tolerance: ±5%; Composition: Thick Film; Features: Automotive AEC-Q200; Operating Temperature: -55°C ~ 155°C; Package / Case: 0402 (1005 Metric); Supplier Device Package: 0402; Size / Dimension: 0.039" L x 0.020" W (1.00mm x 0.50mm); Height - Seated (Max): 0.016" (0.40mm); Number of Terminations: 2; Failure Rate: -

## Sheet SENSORS.SchDoc
size A; SheetNumber: 5; SheetTotal: 5
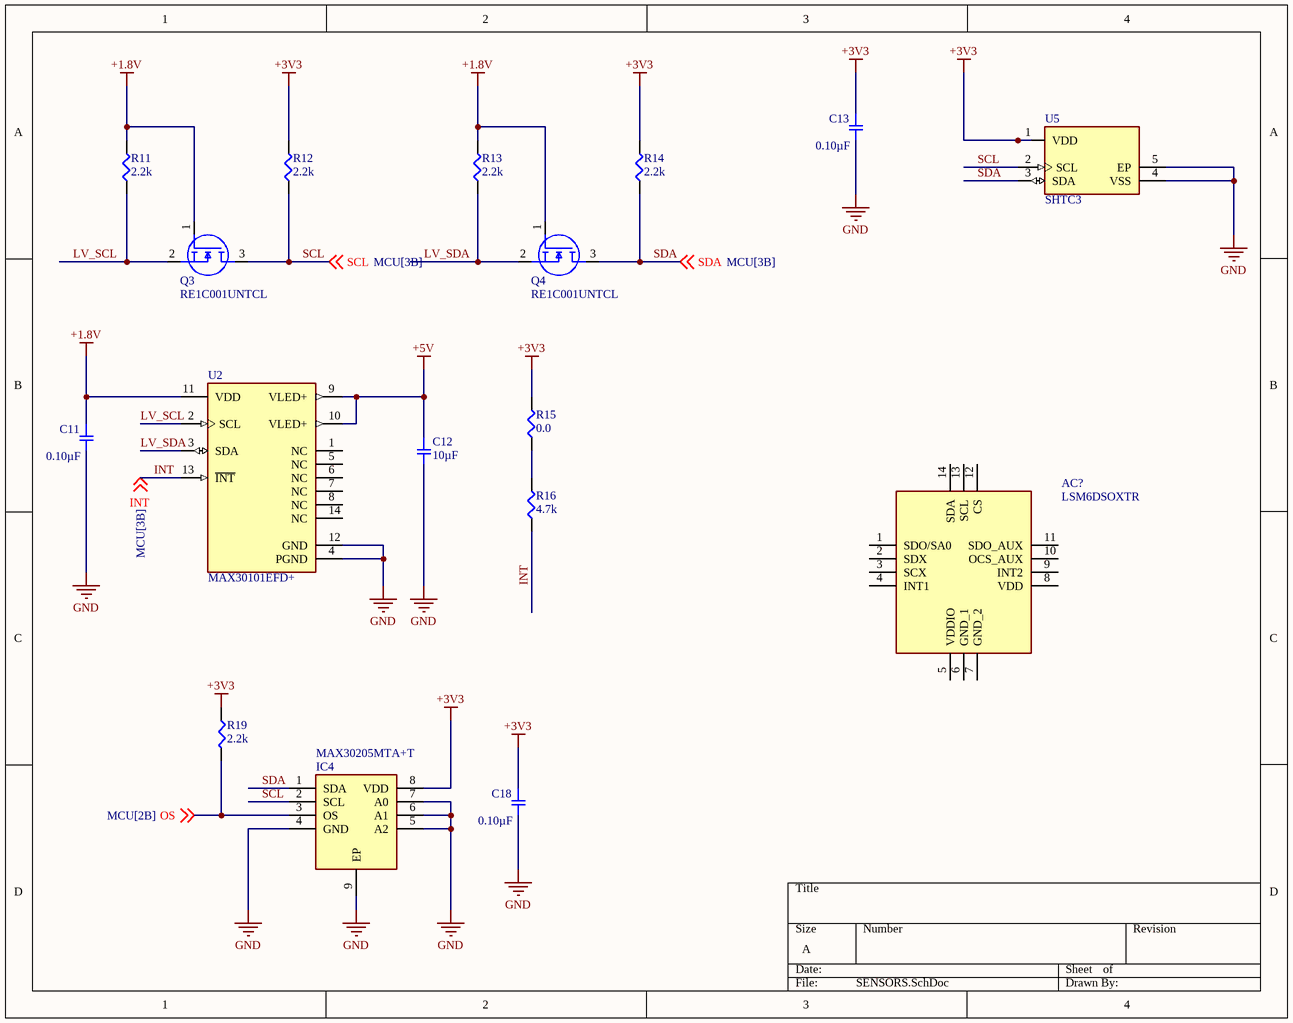
[diagram p4: SENSORS.SchDoc]

### Parts
AC?  LSM6DSOXTR  [LGA-14_1]
C11  0.10µF  [SMD-0402C]
C12  10µF  [SMD-0402C]
C13  0.10µF  [SMD-0402C]
C18  0.10µF  [SMD-0402C]
IC4  MAX30205MTA+T  [SON65P300X300X80-9N]
Q3  RE1C001UNTCL  [SOTFL50P160X85-3N]
Q4  RE1C001UNTCL  [SOTFL50P160X85-3N]
R11  2.2k  [SMD-0402-RES]
R12  2.2k  [SMD-0402-RES]
R13  2.2k  [SMD-0402-RES]
R14  2.2k  [SMD-0402-RES]
R15  0.0  [SMD-0402-RES]
R16  4.7k  [SMD-0402-RES]
R19  2.2k  [SMD-0402-RES]
U2  MAX30101EFD+  [FP-F143A5-1-MFG]
U5  SHTC3  [FP-SHTC3-MFG]

### Nets
+1.8V: C11.1 Q3.1(G) Q4.1(G) R11.2 R13.2 U2.11(VDD)
+3V3: C13.1 C18.1 IC4.8(VDD) R12.2 R14.2 R15.2 R19.1 U5.1(VDD)
+5V: C12.1 U2.9(VLED+) U2.10(VLED+)
GND: C11.2 C12.2 C13.2 C18.2 IC4.4(GND) IC4.5(A2) IC4.6(A1) IC4.7(A0) IC4.9(EP) U2.4(PGND) U2.12(GND) U5.4(VSS) U5.5(EP)
INT: R16.1 U2.13(~{INT}) ; off-sheet INT
LV_SCL: Q3.2(S) R11.1 U2.2(SCL)
LV_SDA: Q4.2(S) R13.1 U2.3(SDA)
OS: IC4.3(OS) R19.2 ; off-sheet OS
SCL: IC4.2(SCL) Q3.3(D) R12.1 U5.2(SCL) ; off-sheet SCL
SDA: IC4.1(SDA) Q4.3(D) R14.1 U5.3(SDA) ; off-sheet SDA
NetR15_1: R15.1 R16.2

Not connected (* = marked no-connect by the designer): AC? 1(SDO/SA0) 2(SDX) 3(SCX) 4(INT1) 5(VDDIO) 6(GND_1) 7(GND_2) 8(VDD) 9(INT2) 10(OCS_AUX) 11(SDO_AUX) 12(CS) 13(SCL) 14(SDA); U2 1(NC) 5(NC) 6(NC) 7(NC) 8(NC) 14(NC)

### Library data of the parts
AC? = LSM6DSOXTR: Accelerometer; Manufacturer_Name: STMicroelectronics; Datasheet Link: https://www.st.com/resource/en/datasheet/lsm6dsox.pdf; Manufacturer_Part_Number: LSM6DSOXTR; Mouser Part Number: 511-LSM6DSOXTR; Mouser Price/Stock: https://www.mouser.co.uk/ProductDetail/STMicroelectronics/LSM6DSOXTR?qs=l7cgNqFNU1i9dcjzItLpVQ%3D%3D; Arrow Part Number: LSM6DSOXTR; Arrow Price/Stock: https://www.arrow.com/en/products/lsm6dsoxtr/stmicroelectronics?utm_currency=USD&region=europe
C11 C13 C18 = GCM155R71C104KA55D: as C21 on sheet MCU; Datasheets: http://www.murata.com/~/media/webrenewal/support/library/catalog/products/capacitor/mlcc/c03e.ashx; Image: //media.digikey.com/Renders/Murata%20Renders/ZRB-SERIES-0402.jpg; Digi-Key Part Number: 490-4759-1-ND; Part Number: GCM155R71C104KA55D; Quantity Available: 734194; @ qty: 0; Packaging: Cut Tape (CT); Series: GCM; Part Status: Active; Value: 0.10µF; Voltage: 16V; Temperature Coefficient: X7R; Operating Temperature: -55°C ~ 125°C; Features: -; Ratings: AEC-Q200; Applications: Automotive; Mounting Type: Surface Mount, MLCC; Package / Case: 0402 (1005 Metric); Size / Dimension: 0.039" L x 0.020" W (1.00mm x 0.50mm); Height - Seated (Max): -; Thickness (Max): 0.022" (0.55mm); Lead Spacing: -; Lead Style: -
C12 = GRJ155R60J106ME11D: as C7 on sheet CHARGING; Datasheets: http://psearch.en.murata.com/capacitor/product/GRJ155R60J106ME11%23.pdf; Image: //media.digikey.com/Renders/Murata%20Renders/ZRB-SERIES-0402.jpg; Digi-Key Part Number: 490-13211-1-ND; Part Number: GRJ155R60J106ME11D; Quantity Available: 64064; @ qty: 0; Packaging: Cut Tape (CT); Series: GRJ; Part Status: Active; Value: 10µF; Voltage: 6.3V; Temperature Coefficient: X5R; Operating Temperature: -55°C ~ 85°C; Features: Derating Recommended, Soft Termination; Ratings: -; Applications: Boardflex Sensitive; Mounting Type: Surface Mount, MLCC; Package / Case: 0402 (1005 Metric); Size / Dimension: 0.039" L x 0.020" W (1.00mm x 0.50mm); Height - Seated (Max): -; Thickness (Max): 0.028" (0.70mm); Lead Spacing: -; Lead Style: -
IC4 = MAX30205MTA+T: Integrated Circuit; Manufacturer_Name: Analog Devices; Datasheet Link: https://datasheets.maximintegrated.com/en/ds/MAX30205.pdf; Height: 0.8mm; Manufacturer_Part_Number: MAX30205MTA+T; Mouser Part Number: 700-MAX30205MTA+T; Mouser Price/Stock: https://www.mouser.co.uk/ProductDetail/Analog-Devices-Maxim-Integrated/MAX30205MTA%2bT?qs=vgjKjNJexThp0Kgta53gGw%3D%3D; Arrow Part Number: MAX30205MTA+T; Arrow Price/Stock: https://www.arrow.com/en/products/max30205mtat/analog-devices?utm_currency=USD&region=nac
Q3 Q4 = RE1C001UNTCL: MOSFET (N-Channel); Manufacturer_Name: ROHM Semiconductor; Datasheet Link: https://datasheet.datasheetarchive.com/originals/distributors/Datasheets_SAMA/a252995f86c5e28cb0f632a782a2eea5.pdf; Height: 0.85mm; Manufacturer_Part_Number: RE1C001UNTCL; Mouser Part Number: 755-RE1C001UNTCL; Mouser Price/Stock: https://www.mouser.co.uk/ProductDetail/ROHM-Semiconductor/RE1C001UNTCL?qs=QcFhgjUTvvoqHeGWcl8O5g%3D%3D
R11-R14 R19 = ERJ-2GEJ222X: RES SMD 2.2K OHM 5% 1/10W 0402; Manufacturer: Panasonic Electronic Components; Factory Stock: 0; Unit Price (USD): 0.00350; @ qty: 1500; Minimum Quantity: 1; Power (Watts): 0.1W, 1/10W; Temperature Coefficient: ±200ppm/°C; Part Number: ERJ-2GEJ222X; Datasheets: http://industrial.panasonic.com/www-cgi/jvcr13pz.cgi?E+PZ+3+AOA0001+ERJ2GEJ222X+7+WW; Image: //media.digikey.com/Photos/Panasonic%20Photos/ERJ-PA2-Series.jpg; Digi-Key Part Number: P2.2KJCT-ND; Quantity Available: 177727; Packaging: Cut Tape (CT); Series: ERJ; Part Status: Active; Value: 2.2k; Tolerance: ±5%; Composition: Thick Film; Features: Automotive AEC-Q200; Operating Temperature: -55°C ~ 155°C; Package / Case: 0402 (1005 Metric); Supplier Device Package: 0402; Size / Dimension: 0.039" L x 0.020" W (1.00mm x 0.50mm); Height - Seated (Max): 0.016" (0.40mm); Number of Terminations: 2; Failure Rate: -
R15 = ERJ-2GE0R00X: RES SMD 0.0OHM JUMPER 1/10W 0402; Manufacturer: Panasonic Electronic Components; Factory Stock: 0; Unit Price (USD): 0.00384; @ qty: 1500; Minimum Quantity: 1; Power (Watts): 0.1W, 1/10W; Part Number: ERJ-2GE0R00X; Datasheets: http://industrial.panasonic.com/www-cgi/jvcr13pz.cgi?E+PZ+3+AOA0001+ERJ2GE0R00X+7+WW; Image: //media.digikey.com/Photos/Panasonic%20Photos/ERJ-PA2-Series.jpg; Digi-Key Part Number: P0.0JCT-ND; Quantity Available: 3152483; Packaging: Cut Tape (CT); Series: ERJ; Part Status: Active; Value: 0.0; Tolerance: Jumper; Composition: Thick Film; Features: Automotive AEC-Q200; Temperature Coefficient: -; Operating Temperature: -55°C ~ 155°C; Package / Case: 0402 (1005 Metric); Supplier Device Package: 0402; Size / Dimension: 0.039" L x 0.020" W (1.00mm x 0.50mm); Height - Seated (Max): 0.016" (0.40mm); Number of Terminations: 2; Failure Rate: -
R16 = ERJ-2GEJ472X: RES SMD 4.7K OHM 5% 1/10W 0402; Manufacturer: Panasonic Electronic Components; Factory Stock: 0; Unit Price (USD): 0.00350; @ qty: 1500; Minimum Quantity: 1; Power (Watts): 0.1W, 1/10W; Temperature Coefficient: ±200ppm/°C; Part Number: ERJ-2GEJ472X; Datasheets: http://industrial.panasonic.com/www-cgi/jvcr13pz.cgi?E+PZ+3+AOA0001+ERJ2GEJ472X+7+WW; Image: //media.digikey.com/Photos/Panasonic%20Photos/ERJ-PA2-Series.jpg; Digi-Key Part Number: P4.7KJCT-ND; Quantity Available: 8551774; Packaging: Cut Tape (CT); Series: ERJ; Part Status: Active; Value: 4.7k; Tolerance: ±5%; Composition: Thick Film; Features: Automotive AEC-Q200; Operating Temperature: -55°C ~ 155°C; Package / Case: 0402 (1005 Metric); Supplier Device Package: 0402; Size / Dimension: 0.039" L x 0.020" W (1.00mm x 0.50mm); Height - Seated (Max): 0.016" (0.40mm); Number of Terminations: 2; Failure Rate: -
U2 = CMP-05738-000001-1: INTEGRATED OPTICAL SENSOR; Manufacturer: Maxim Integrated; Max Supply Voltage: 2V; Max Junction Temp: +90°C; Operating Supply Current: 600uA; Min Supply Voltage: 1.7V; Sensor Output: I2C; RoHS: TRUE; Footprint Url: https://pdfserv.maximintegrated.com/land_patterns/90-0602.PDF; Manufacturer Part Number: MAX30101EFD+; Device Class L2: unset; Temperature Range Low: -40°C; Automotive: No; Height: 1.65mm; Temperature Range High: +85°C; ComponentLink2Description: Datasheet; Mouser Description: INTEGRATED OPTICAL SENSOR; ComponentLink2URL: https://datasheets.maximintegrated.com/en/ds/MAX30101.pdf; Octopart: https://octopart.com/max30101efd%2B-maxim+integrated-57054333; Temperature: -40°C to +85°C; Package: F143A5-1; Lead Free: Yes; Device Class L1: Sensors; Digikey Description: INTEGRATED OPTICAL SENSOR; Category: IC; Device Class L3: unset
U5 = CMP-144040-000003-1: SENSOR HUMI/TEMP I2C 2% SMD; Manufacturer: Sensirion; Operating Supply Current: 0.3-900uA; Resolution: 16bits; Min Supply Voltage: 1.62V; Max Supply Voltage: 3.6V; Category: IC; Device Class L3: unset; ComponentLink2URL: https://www.sensirion.com/fileadmin/user_upload/customers/sensirion/Dokumente/0_Datasheets/Humidity/Sensirion_Humidity_Sensors_SHTC3_Datasheet.pdf; Ipc Land Pattern Name: DFN200X200X75-4; RoHS: TRUE; Height: 0.75mm; Interface: I2C; Temperature Range High: +125°C; Accuracy: 2%; Sensor Output: I2C; Automotive: No; Package: 0; Device Class L1: Sensors; Manufacturer Part Number: SHTC3; Digikey Description: SENSOR HUMI/TEMP I2C 2% SMD; Lead Free: Yes; Temperature: -40°C to +125°C; Device Class L2: Temperature and Humidity Sensors; ComponentLink2Description: Datasheet; Octopart: https://octopart.com/shtc3-sensirion-91912225; Mouser Description: SHTC3 Series 0 to 100% RH 3.6 V Humidity and Temperature Sensor IC - DFN-4; Temperature Range Low: -40°C

## Nets that join several sheets
+1.8V: POWER (C5.1 IC1.5 TP2.TP), SENSORS (6 pins)
+3V3: MCU (5 pins), POWER (13 pins), ALERT (C22.1 IC6.4 LS1.1), SENSORS (8 pins)
+5V: POWER (C9.1 IC3.7 R9.1 TP3.TP), SENSORS (C12.1 U2.9 U2.10)
GND: MCU (19 pins), POWER (17 pins), CHARGING (12 pins), ALERT (C22.2 IC6.2 Q5.2 R23.1), SENSORS (13 pins)
VIN: POWER (C2.1 U1.5 U1.7 U1.8), CHARGING (D3.1 Q2.2)
BUZZER: MCU (IC5.37), ALERT (R22.1)
INT: MCU (IC5.28), SENSORS (R16.1 U2.13)
LED: MCU (IC5.27), ALERT (IC6.3)
OS: MCU (IC5.11), SENSORS (IC4.3 R19.2)
SCL: MCU (IC5.36), SENSORS (IC4.2 Q3.3 R12.1 U5.2)
SDA: MCU (IC5.33), SENSORS (IC4.1 Q4.3 R14.1 U5.3)